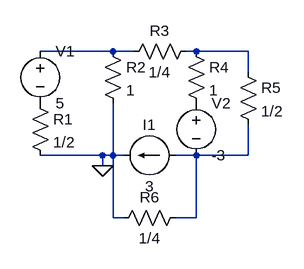
[diagram p0: schematic 2GT1GC.asc]
2GT1GC.asc, the LTspice schematic file:
Version 4
SHEET 1 880 680
WIRE 48 96 -64 96
WIRE 80 96 48 96
WIRE 176 96 160 96
WIRE 256 96 176 96
WIRE 256 128 256 96
WIRE 32 256 -64 256
WIRE 48 256 48 176
WIRE 48 256 32 256
WIRE 64 256 48 256
WIRE 176 256 144 256
WIRE 256 256 256 208
WIRE 256 256 176 256
WIRE 32 272 32 256
WIRE 48 352 48 256
WIRE 64 352 48 352
WIRE 176 352 176 256
WIRE 176 352 144 352
FLAG 32 272 0
SYMBOL res -80 160 R0
SYMATTR InstName R1
SYMATTR Value 1/2
SYMBOL res 32 80 R0
SYMATTR InstName R2
SYMATTR Value 1
SYMBOL res 176 80 R90
WINDOW 0 0 56 VBottom 2
WINDOW 3 32 56 VTop 2
SYMATTR InstName R3
SYMATTR Value 1/4
SYMBOL res 160 80 R0
SYMATTR InstName R4
SYMATTR Value 1
SYMBOL res 240 112 R0
SYMATTR InstName R5
SYMATTR Value 1/2
SYMBOL res 160 336 R90
WINDOW 0 0 56 VBottom 2
WINDOW 3 32 56 VTop 2
SYMATTR InstName R6
SYMATTR Value 1/4
SYMBOL current 144 256 R90
WINDOW 0 -32 40 VBottom 2
WINDOW 3 32 40 VTop 2
WINDOW 123 0 0 Left 0
WINDOW 39 0 0 Left 0
SYMATTR InstName I1
SYMATTR Value 3
SYMBOL voltage -64 80 R0
WINDOW 123 0 0 Left 0
WINDOW 39 0 0 Left 0
SYMATTR InstName V1
SYMATTR Value 5
SYMBOL voltage 176 160 R0
WINDOW 123 0 0 Left 0
WINDOW 39 0 0 Left 0
SYMATTR InstName V2
SYMATTR Value -3

The netlist it stands for:
* 2GT1GC.asc
R1 P001 0 1/2
R2 N001 0 1
R3 N002 N001 1/4
R4 N002 P002 1
R5 N002 N003 1/2
R6 N003 0 1/4
I1 N003 0 3
V1 N001 P001 5
V2 P002 N003 -3
.backanno
.end